# Altium schematic sheet MCU-CTRLA.SchDoc
size A3
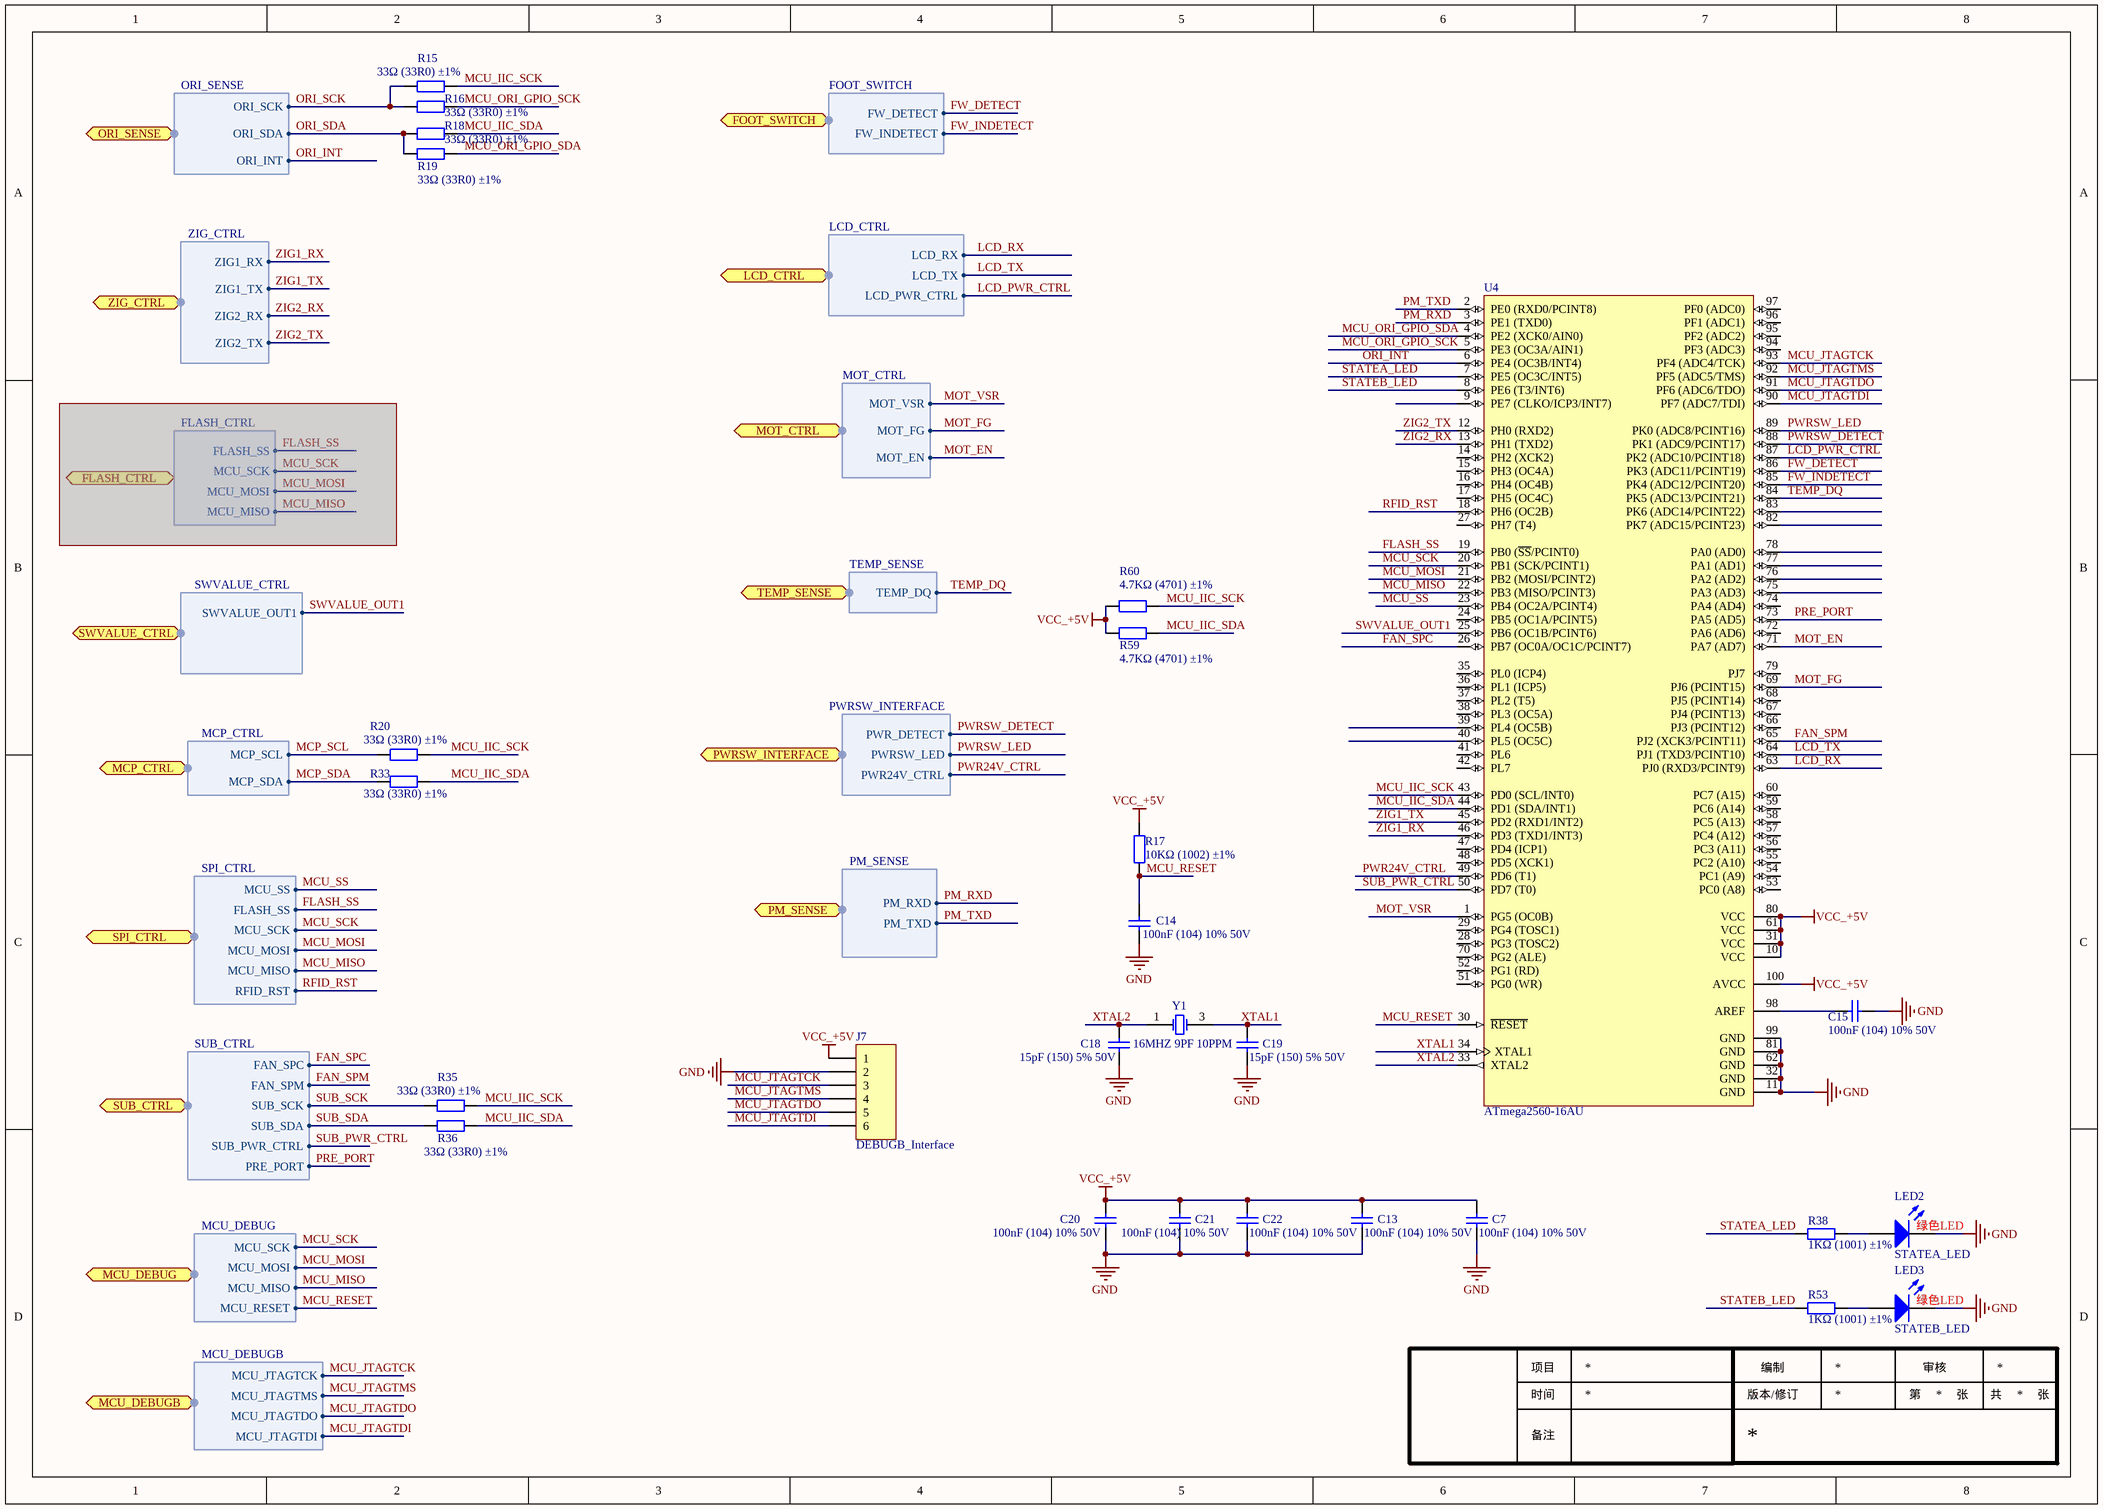
[diagram p0: MCU-CTRLA.SchDoc]

## Parts
C7  100nF (104) 10% 50V  [LC-0603_C]
C13  100nF (104) 10% 50V  [LC-0603_C]
C14  100nF (104) 10% 50V  [LC-0603_C]
C15  100nF (104) 10% 50V  [LC-0603_C]
C18  15pF (150) 5% 50V  [LC-0603_C]
C19  15pF (150) 5% 50V  [LC-0603_C]
C20  100nF (104) 10% 50V  [LC-0603_C]
C21  100nF (104) 10% 50V  [LC-0603_C]
C22  100nF (104) 10% 50V  [LC-0603_C]
J7  DEBUGB_Interface  [MHDR1X6]
LED2  STATEA_LED  [LC-0603_LED_S1]
LED3  STATEB_LED  [LC-0603_LED_S1]
R15  33Ω (33R0) ±1%  [LC-0603_R]
R16  33Ω (33R0) ±1%  [LC-0603_R]
R17  10KΩ (1002) ±1%  [LC-0603_R]
R18  33Ω (33R0) ±1%  [LC-0603_R]
R19  33Ω (33R0) ±1%  [LC-0603_R]
R20  33Ω (33R0) ±1%  [LC-0603_R]
R33  33Ω (33R0) ±1%  [LC-0603_R]
R35  33Ω (33R0) ±1%  [LC-0603_R]
R36  33Ω (33R0) ±1%  [LC-0603_R]
R38  1KΩ (1001) ±1%  [LC-0603_R]
R53  1KΩ (1001) ±1%  [LC-0603_R]
R59  4.7KΩ (4701) ±1%  [LC-0603_R]
R60  4.7KΩ (4701) ±1%  [LC-0603_R]
U4  ATmega2560-16AU  [100A_N]
Y1  16MHZ 9PF 10PPM  [LC-SMD-3225_4P]

## Ports
FLASH_CTRL (harness FLASH_CTRL), FOOT_SWITCH (harness FOOT_SWITCH), LCD_CTRL (harness LCD_CTRL), MCP_CTRL (harness MCP_CTRL), MCU_DEBUG (harness MCU_DEBUG), MCU_DEBUGB (harness MCU_DEBUGB), MOT_CTRL (harness MOT_CTRL), ORI_SENSE (harness ORI_SENSE), PM_SENSE (harness PM_SENSE), PWRSW_INTERFACE (harness PWRSW_INTERFACE), SPI_CTRL (harness SPI_CTRL), SUB_CTRL (harness SUB_CTRL), SWVALUE_CTRL (harness SWVALUE_CTRL), TEMP_SENSE (harness TEMP_SENSE), ZIG_CTRL (harness ZIG_CTRL)

## Harnesses
ORI_SENSE: ORI_SCK, ORI_SDA, ORI_INT
ZIG_CTRL: ZIG1_RX, ZIG1_TX, ZIG2_RX, ZIG2_TX
FLASH_CTRL: FLASH_SS, MCU_SCK, MCU_MOSI, MCU_MISO
SWVALUE_CTRL: SWVALUE_OUT1
SPI_CTRL: MCU_SS, MCU_SCK, MCU_MOSI, MCU_MISO, RFID_RST, FLASH_SS
SUB_CTRL: FAN_SPC, FAN_SPM, SUB_SCK, SUB_SDA, SUB_PWR_CTRL, PRE_PORT
MCU_DEBUG: MCU_SCK, MCU_MOSI, MCU_MISO, MCU_RESET
FOOT_SWITCH: FW_DETECT, FW_INDETECT
LCD_CTRL: LCD_RX, LCD_TX, LCD_PWR_CTRL
MOT_CTRL: MOT_VSR, MOT_FG, MOT_EN
TEMP_SENSE: TEMP_DQ
MCP_CTRL: MCP_SCL, MCP_SDA
PWRSW_INTERFACE: PWR_DETECT, PWRSW_LED, PWR24V_CTRL
PM_SENSE: PM_RXD, PM_TXD
MCU_DEBUGB: MCU_JTAGTCK, MCU_JTAGTMS, MCU_JTAGTDO, MCU_JTAGTDI

## Nets
GND: C7.1 C13.1 C14.1 C15.1 C18.1 C19.1 C20.1 C21.1 C22.1 J7.2 LED2.K LED3.K U4.11(GND) U4.32(GND) U4.62(GND) U4.81(GND) U4.99(GND)
VCC_+5V: C7.2 C13.2 C20.2 C21.2 C22.2 J7.1 R17.2 R59.2 R60.2 U4.10(VCC) U4.31(VCC) U4.61(VCC) U4.80(VCC) U4.100(AVCC)
FAN_SPC: U4.26(PB7_(OC0A/OC1C/PCINT7)) ; port SUB_CTRL.FAN_SPC
FAN_SPM: U4.65(PJ2_(XCK3/PCINT11)) ; port SUB_CTRL.FAN_SPM
FLASH_SS: U4.19(PB0_(~{SS}/PCINT0)) ; port SPI_CTRL.FLASH_SS
FW_DETECT: U4.86(PK3_(ADC11/PCINT19)) ; port FOOT_SWITCH.FW_DETECT
FW_INDETECT: U4.85(PK4_(ADC12/PCINT20)) ; port FOOT_SWITCH.FW_INDETECT
LCD_PWR_CTRL: U4.87(PK2_(ADC10/PCINT18)) ; port LCD_CTRL.LCD_PWR_CTRL
LCD_RX: U4.63(PJ0_(RXD3/PCINT9)) ; port LCD_CTRL.LCD_RX
LCD_TX: U4.64(PJ1_(TXD3/PCINT10)) ; port LCD_CTRL.LCD_TX
MCP_SCL: R20.1 ; port MCP_CTRL.MCP_SCL
MCP_SDA: R33.1 ; port MCP_CTRL.MCP_SDA
MCU_IIC_SCK: R15.2 R20.2 R35.2 R60.1 U4.43(PD0_(SCL/INT0))
MCU_IIC_SDA: R18.2 R33.2 R36.2 R59.1 U4.44(PD1_(SDA/INT1))
MCU_JTAGTCK: J7.3 U4.93(PF4_(ADC4/TCK)) ; port MCU_DEBUGB.MCU_JTAGTCK
MCU_JTAGTDI: J7.6 U4.90(PF7_(ADC7/TDI)) ; port MCU_DEBUGB.MCU_JTAGTDI
MCU_JTAGTDO: J7.5 U4.91(PF6_(ADC6/TDO)) ; port MCU_DEBUGB.MCU_JTAGTDO
MCU_JTAGTMS: J7.4 U4.92(PF5_(ADC5/TMS)) ; port MCU_DEBUGB.MCU_JTAGTMS
MCU_MISO: U4.22(PB3_(MISO/PCINT3)) ; port SPI_CTRL.MCU_MISO, port MCU_DEBUG.MCU_MISO
MCU_MOSI: U4.21(PB2_(MOSI/PCINT2)) ; port SPI_CTRL.MCU_MOSI, port MCU_DEBUG.MCU_MOSI
MCU_ORI_GPIO_SCK: R16.2 U4.5(PE3_(OC3A/AIN1))
MCU_ORI_GPIO_SDA: R19.2 U4.4(PE2_(XCK0/AIN0))
MCU_RESET: C14.2 R17.1 U4.30(~{RESET}) ; port MCU_DEBUG.MCU_RESET
MCU_SCK: U4.20(PB1_(SCK/PCINT1)) ; port SPI_CTRL.MCU_SCK, port MCU_DEBUG.MCU_SCK
MCU_SS: U4.23(PB4_(OC2A/PCINT4)) ; port SPI_CTRL.MCU_SS
MOT_EN: U4.71(PA7_(AD7)) ; port MOT_CTRL.MOT_EN
MOT_FG: U4.69(PJ6_(PCINT15)) ; port MOT_CTRL.MOT_FG
MOT_VSR: U4.1(PG5_(OC0B)) ; port MOT_CTRL.MOT_VSR
ORI_INT: U4.6(PE4_(OC3B/INT4)) ; port ORI_SENSE.ORI_INT
ORI_SCK: R15.1 R16.1 ; port ORI_SENSE.ORI_SCK
ORI_SDA: R18.1 R19.1 ; port ORI_SENSE.ORI_SDA
PM_RXD: U4.3(PE1_(TXD0)) ; port PM_SENSE.PM_RXD
PM_TXD: U4.2(PE0_(RXD0/PCINT8)) ; port PM_SENSE.PM_TXD
PRE_PORT: U4.73(PA5_(AD5)) ; port SUB_CTRL.PRE_PORT
PWR24V_CTRL: U4.49(PD6_(T1)) ; port PWRSW_INTERFACE.PWR24V_CTRL
PWRSW_DETECT: U4.88(PK1_(ADC9/PCINT17)) ; port PWRSW_INTERFACE.PWR_DETECT
PWRSW_LED: U4.89(PK0_(ADC8/PCINT16)) ; port PWRSW_INTERFACE.PWRSW_LED
RFID_RST: U4.18(PH6_(OC2B)) ; port SPI_CTRL.RFID_RST
STATEA_LED: R38.1 U4.7(PE5_(OC3C/INT5))
STATEB_LED: R53.1 U4.8(PE6_(T3/INT6))
SUB_PWR_CTRL: U4.50(PD7_(T0)) ; port SUB_CTRL.SUB_PWR_CTRL
SUB_SCK: R35.1 ; port SUB_CTRL.SUB_SCK
SUB_SDA: R36.1 ; port SUB_CTRL.SUB_SDA
SWVALUE_OUT1: U4.25(PB6_(OC1B/PCINT6)) ; port SWVALUE_CTRL.SWVALUE_OUT1
TEMP_DQ: U4.84(PK5_(ADC13/PCINT21)) ; port TEMP_SENSE.TEMP_DQ
XTAL1: C19.2 U4.34(XTAL1) Y1.3(OSC2)
XTAL2: C18.2 U4.33(XTAL2) Y1.1(OSC1)
ZIG1_RX: U4.46(PD3_(TXD1/INT3)) ; port ZIG_CTRL.ZIG1_RX
ZIG1_TX: U4.45(PD2_(RXD1/INT2)) ; port ZIG_CTRL.ZIG1_TX
ZIG2_RX: U4.13(PH1_(TXD2)) ; port ZIG_CTRL.ZIG2_RX
ZIG2_TX: U4.12(PH0_(RXD2)) ; port ZIG_CTRL.ZIG2_TX
NetC15_2: C15.2 U4.98(AREF)
NetLED2_A: LED2.A R38.2
NetLED3_A: LED3.A R53.2

Not connected (* = marked no-connect by the designer): U4 9(PE7_(CLKO/ICP3/INT7)) 14(PH2_(XCK2)) 15(PH3_(OC4A)) 16(PH4_(OC4B)) 17(PH5_(OC4C)) 24(PB5_(OC1A/PCINT5)) 27(PH7_(T4)) 28(PG3_(TOSC2)) 29(PG4_(TOSC1)) 35(PL0_(ICP4)) 36(PL1_(ICP5)) 37(PL2_(T5)) 38(PL3_(OC5A)) 39(PL4_(OC5B)) 40(PL5_(OC5C)) 41(PL6) 42(PL7) 47(PD4_(ICP1)) 48(PD5_(XCK1)) 51(PG0_(WR)) 52(PG1_(RD)) 53(PC0_(A8)) 54(PC1_(A9)) 55(PC2_(A10)) 56(PC3_(A11)) 57(PC4_(A12)) 58(PC5_(A13)) 59(PC6_(A14)) 60(PC7_(A15)) 66(PJ3_(PCINT12)) 67(PJ4_(PCINT13)) 68(PJ5_(PCINT14)) 70(PG2_(ALE)) 72(PA6_(AD6)) 74(PA4_(AD4)) 75(PA3_(AD3)) 76(PA2_(AD2)) 77(PA1_(AD1)) 78(PA0_(AD0)) 79(PJ7) 82(PK7_(ADC15/PCINT23)) 83(PK6_(ADC14/PCINT22)) 94(PF3_(ADC3)) 95(PF2_(ADC2)) 96(PF1_(ADC1)) 97(PF0_(ADC0))

## Notes on the sheet
- (near LED2) 绿色LED
- (near LED3) 绿色LED
- 项目
- 时间
- 版本/修订
- 编制
- 第
- 审核
- 张
- 共
- 备注

## Library data of the parts
C7 C13-C15 C20-C22 = 0603 100nF (104) 10% 50V: 贴片电容; ComponentLink1Description: 供应商链接; ComponentLink1URL: http://www.szlcsc.com/product/details_15331.html; Package: 0603; Supplier: LC; SuppliersPartNumber: C14663
C18 C19 = 0603 15pF (150) 5% 50V: 贴片电容; ComponentLink1Description: 供应商链接; ComponentLink1URL: http://www.szlcsc.com/product/details_1996.html; Package: 0603; Supplier: LC; SuppliersPartNumber: C1644
J7 = MHDR1X6: Header, 6-Pin; LatestRevisionDate: 17-Jul-2002; LatestRevisionNote: Re-released for DXP Platform.; Publisher: Altium Limited
LED2 LED3 = LEDA: Libnum: *; Manufacture: *; Odering: *
  LED2: Comments: STATEA_LED
  LED3: Comments: STATEB_LED
R15 R16 R18-R20 R33 R35 R36 = 0603 33Ω (33R0) 1%: 贴片电阻; ComponentLink1Description: 供应商链接; ComponentLink1URL: http://www.szlcsc.com/product/details_23867.html; Package: 0603; Supplier: LC; SuppliersPartNumber: C23140
R17 = 0603 10KΩ (1002) 1%: 贴片电阻; ComponentLink1Description: 供应商链接; ComponentLink1URL: http://www.szlcsc.com/product/details_26547.html; Package: 0603; Supplier: LC; SuppliersPartNumber: C25804
R38 R53 = 0603 1KΩ (1001) 1%: 贴片电阻; ComponentLink1Description: 供应商链接; ComponentLink1URL: http://www.szlcsc.com/product/details_21904.html; Package: 0603; Supplier: LC; SuppliersPartNumber: C21190
R59 R60 = 0603 4.7KΩ (4701) 1%: 贴片电阻; ComponentLink1Description: 供应商链接; ComponentLink1URL: http://www.szlcsc.com/product/details_23889.html; Package: 0603; Supplier: LC; SuppliersPartNumber: C23162
U4 = ATmega2560-16AU: 8-bit AVR Microcontroller, 4.5-5.5V, 16MHz, 256KB Flash, 4KB EEPROM, 8KB SRAM, 86 GPIO pins, 100-pin TQFP, Industrial Grade (-40°C to 85°C), Pb-Free; DatasheetVersion: revN, May-2011; PackageVersion: revD, Oct-2010; PackageReference: 100A; PackageDescription: 100-Pin Thin Profile Plastic Quad Flat Pack (TQFP), 14 x 14 x 1.0 mm Body, 0.5 mm Pitch; Code_JEDEC: MS-026-AED; ComponentLink1Description: Manufacturer URL; ComponentLink1URL: http://www.atmel.com/; ComponentLink2Description: ATmega640/1280/1281/2560/2561 Datasheet; ComponentLink2URL: http://www.atmel.com/dyn/resources/prod_documents/doc2549.pdf; ComponentLink3Description: ATmega640/1280/1281/2560/2561 Summary; ComponentLink3URL: http://www.atmel.com/dyn/resources/prod_documents/2549S.pdf
Y1 = SMD-3225_4P  16MHZ 9PF 10PPM: 贴片晶振; ComponentLink1Description: 供应商链接; ComponentLink1URL: http://www.szlcsc.com/product/details_14393.html; Package: SMD-3225_4P; Supplier: LC; SuppliersPartNumber: C13738